# EAGLE design rangefinder_adaptor (EAGLE 6.3)
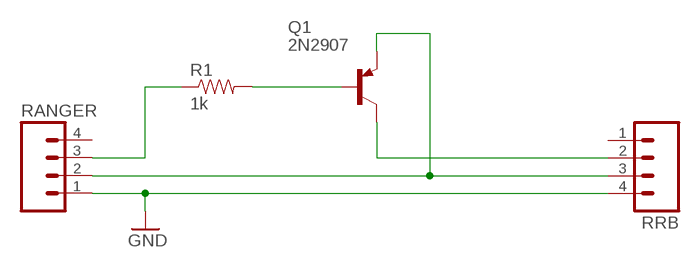
[diagram p0: schematic, sheet 1]

## Parts
Q1  2N2907  [TO92-EBC-OVAL]
R1  1k  RESISTORPTH-1/4W  [AXIAL-0.4]
RANGER  M04LONGPADS  [1X04_LONGPADS]
RRB  M04LONGPADS  [1X04_LONGPADS]

## Nets
GND: RANGER.1 RRB.4
N$2: Q1.E RANGER.2 RRB.3
N$3: R1.P$1 RANGER.3
N$4: Q1.B R1.P$2
N$5: Q1.C RRB.2
Unconnected: RANGER.4 RRB.1

## Library data of the parts
Q1 = adafruit:2N2907*: PNP Transistor Big Oval pads
R1 = SparkFun:RESISTOR: Resistor Basic schematic elements and footprints for 0603, 1206, and PTH resistors.
RANGER RRB = SparkFun:M04: Header 4 Standard 4-pin 0.1" header. Use with straight break away headers (SKU : PRT-00116), right angle break away headers (PRT-00553), swiss pins (PRT-00743), machine pins (PRT-00117), and female headers (PRT-00115). Molex polarized connector foot print use with SKU : PRT-08231 with associated crimp pins and housings. 1MM SMD Version SKU: PRT-10208

## Board
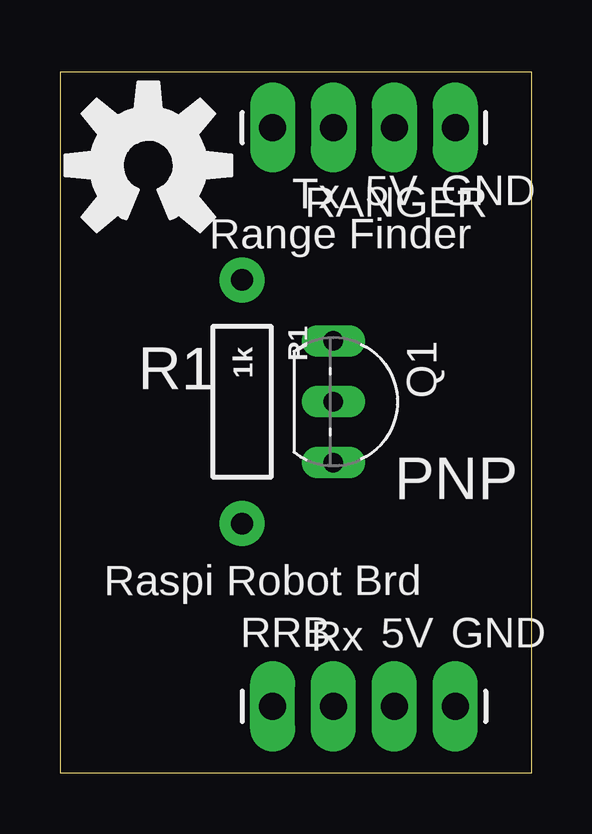
[diagram p1: board, top side]
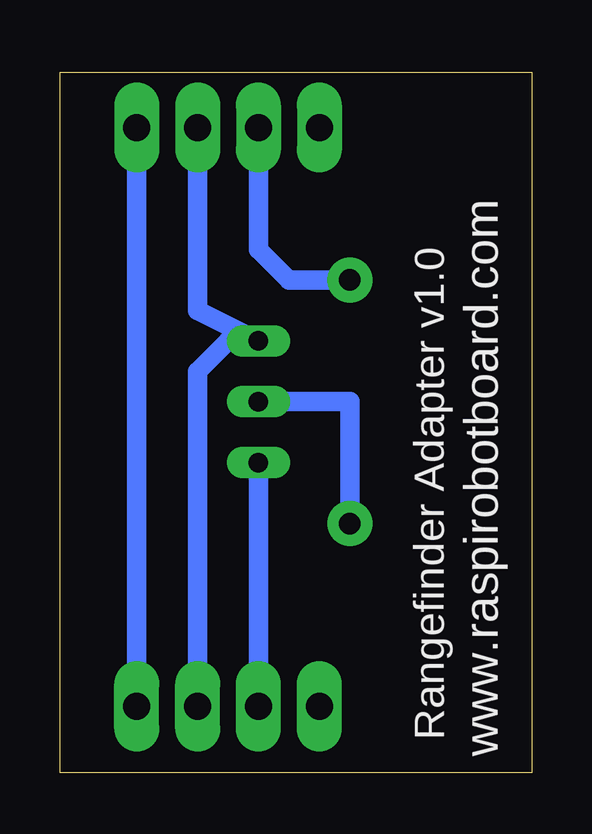
[diagram p2: board, bottom side, seen from below]

Size 19.69 x 29.2 mm. Coordinates in mm from the lower left corner, seen from the top.
Outline: 0,0 19.68,0 19.68,29.2 0,29.2 0,0
Copper layers (1*16): Top 0.035mm / dielectric 1.5mm / Bottom 0.035mm
Design rules "default": minimum track width 10mil, minimum drill 24mil, track to track 8mil, track to pad 8mil, pad to pad 8mil, via to via 8mil, smd to smd 8mil, copper to edge 40mil, drill to drill 8mil, minimum pad ring 10mil, minimum via ring 8mil, stop-mask expansion 4mil, vias tented up to drill 0mil, thermal gap 10mil

### Footprints (pad centres in the part's own frame; a part is rotated, then mirrored left to right if it is on the bottom)
TO92-EBC-OVAL = drill 0.813 long: B 0,-1.27; C 2.54,-1.27; E -2.54,-1.27
AXIAL-0.4 = drill 0.9 pad 1.88: P$1 -5.08,0; P$2 5.08,0
1X04_LONGPADS = drill 1.118 pad 1.88 long: 1 0,0; 2 2.54,0; 3 5.08,0; 4 7.62,0

### Placement (x,y rotation side)
Q1  12.67,15.47 270 top
R1  7.59,15.47 270 top
RANGER  16.48,26.9 180 top
RRB  8.86,2.77 0 top
U$1  [OSHW-LOGO-L]  3.68,25.32 0 top

### Tracks (layer width: path | path; a pad name or v marks a point on that pad's centre or on a via)
GND
  Bottom 0.813: RANGER.1 RRB.4
N$2
  Bottom 0.813: RANGER.2 13.95,19.28 Q1.E 12.68,18.01 13.95,16.74 RRB.3
N$3
  Bottom 0.813: R1.P$1 10.13,20.55 11.4,21.82 RANGER.3
N$4
  Bottom 0.813: R1.P$2 7.59,15.47 Q1.B
N$5
  Bottom 0.813: Q1.C RRB.2

### Text on the board
tPlace: Tx | 5V | GND | Range Finder | R1 | PNP | Raspi Robot Brd | Rx | 5V | GND
bPlace: www.raspirobotboard.com | Rangefinder Adapter v1.0